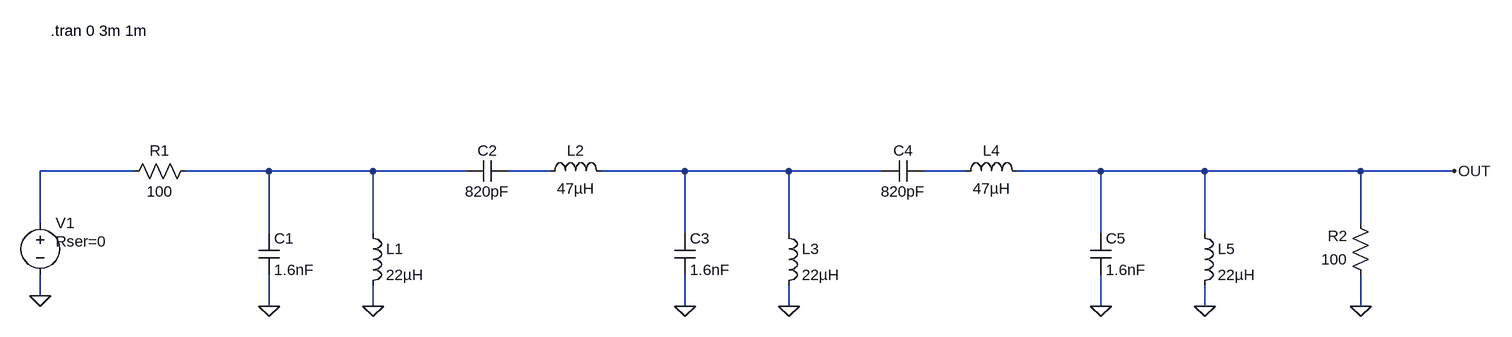
[diagram p0: schematic 2020_filter_experiments_v1.asc]
2020_filter_experiments_v1.asc, the LTspice schematic file:
Version 4
SHEET 1 2244 680
WIRE 144 48 0 48
WIRE 352 48 224 48
WIRE 512 48 352 48
WIRE 656 48 512 48
WIRE 784 48 720 48
WIRE 992 48 864 48
WIRE 1152 48 992 48
WIRE 1296 48 1152 48
WIRE 1424 48 1360 48
WIRE 1632 48 1504 48
WIRE 1792 48 1632 48
WIRE 2032 48 1792 48
WIRE 2176 48 2032 48
WIRE 0 128 0 48
WIRE 2032 128 2032 48
WIRE 352 144 352 48
WIRE 512 144 512 48
WIRE 992 144 992 48
WIRE 1152 144 1152 48
WIRE 1632 144 1632 48
WIRE 1792 144 1792 48
WIRE 0 240 0 208
WIRE 352 256 352 208
WIRE 512 256 512 224
WIRE 992 256 992 208
WIRE 1152 256 1152 224
WIRE 1632 256 1632 208
WIRE 1792 256 1792 224
WIRE 2032 256 2032 208
FLAG 0 240 0
FLAG 352 256 0
FLAG 512 256 0
FLAG 992 256 0
FLAG 1152 256 0
FLAG 1632 256 0
FLAG 1792 256 0
FLAG 2032 256 0
FLAG 2176 48 OUT
SYMBOL voltage 0 112 R0
WINDOW 3 24 96 Invisible 2
WINDOW 123 0 0 Left 0
WINDOW 39 24 44 Left 2
SYMATTR InstName V1
SYMATTR Value SINE(0 1 1000000)
SYMATTR SpiceLine Rser=0
SYMBOL res 240 32 R90
WINDOW 0 0 56 VBottom 2
WINDOW 3 32 56 VTop 2
SYMATTR InstName R1
SYMATTR Value 100
SYMBOL cap 336 144 R0
SYMATTR InstName C1
SYMATTR Value 1.6nF
SYMBOL ind 496 128 R0
SYMATTR InstName L1
SYMATTR Value 22µH
SYMATTR SpiceLine Rser=1
SYMBOL cap 720 32 R90
WINDOW 0 0 32 VBottom 2
WINDOW 3 32 32 VTop 2
SYMATTR InstName C2
SYMATTR Value 820pF
SYMBOL ind 768 64 R270
WINDOW 0 32 56 VTop 2
WINDOW 3 5 56 VBottom 2
SYMATTR InstName L2
SYMATTR Value 47µH
SYMATTR SpiceLine Rser=2
SYMBOL cap 976 144 R0
SYMATTR InstName C3
SYMATTR Value 1.6nF
SYMBOL ind 1136 128 R0
SYMATTR InstName L3
SYMATTR Value 22µH
SYMATTR SpiceLine Rser=1
SYMBOL cap 1360 32 R90
WINDOW 0 0 32 VBottom 2
WINDOW 3 32 32 VTop 2
SYMATTR InstName C4
SYMATTR Value 820pF
SYMBOL ind 1408 64 R270
WINDOW 0 32 56 VTop 2
WINDOW 3 5 56 VBottom 2
SYMATTR InstName L4
SYMATTR Value 47µH
SYMATTR SpiceLine Rser=2
SYMBOL cap 1616 144 R0
SYMATTR InstName C5
SYMATTR Value 1.6nF
SYMBOL ind 1776 128 R0
SYMATTR InstName L5
SYMATTR Value 22µH
SYMATTR SpiceLine Rser=1
SYMBOL res 2048 224 R180
WINDOW 0 36 76 Left 2
WINDOW 3 36 40 Left 2
SYMATTR InstName R2
SYMATTR Value 100
TEXT 16 -168 Left 2 !.tran 0 3m 1m

The netlist it stands for:
* 2020_filter_experiments_v1.asc
V1 N001 0 SINE(0 1 1000000) Rser=0
R1 N002 N001 100
C1 N002 0 1.6nF
L1 N002 0 22µH Rser=1
C2 N003 N002 820pF
L2 N003 N004 47µH Rser=2
C3 N004 0 1.6nF
L3 N004 0 22µH Rser=1
C4 N005 N004 820pF
L4 N005 OUT 47µH Rser=2
C5 OUT 0 1.6nF
L5 OUT 0 22µH Rser=1
R2 0 OUT 100
.tran 0 3m 1m
.backanno
.end